# Altium schematic sheet pca10156_sheet2_nRF54L15.SchDoc: =BoardTitle+'- nRF54L15'
size A3; Organization: Nordic Semiconductor; DocumentNumber: 2; SheetNumber: 2; SheetTotal: 7; CompanyName: Nordic Semiconductor; DocumentSize: A4
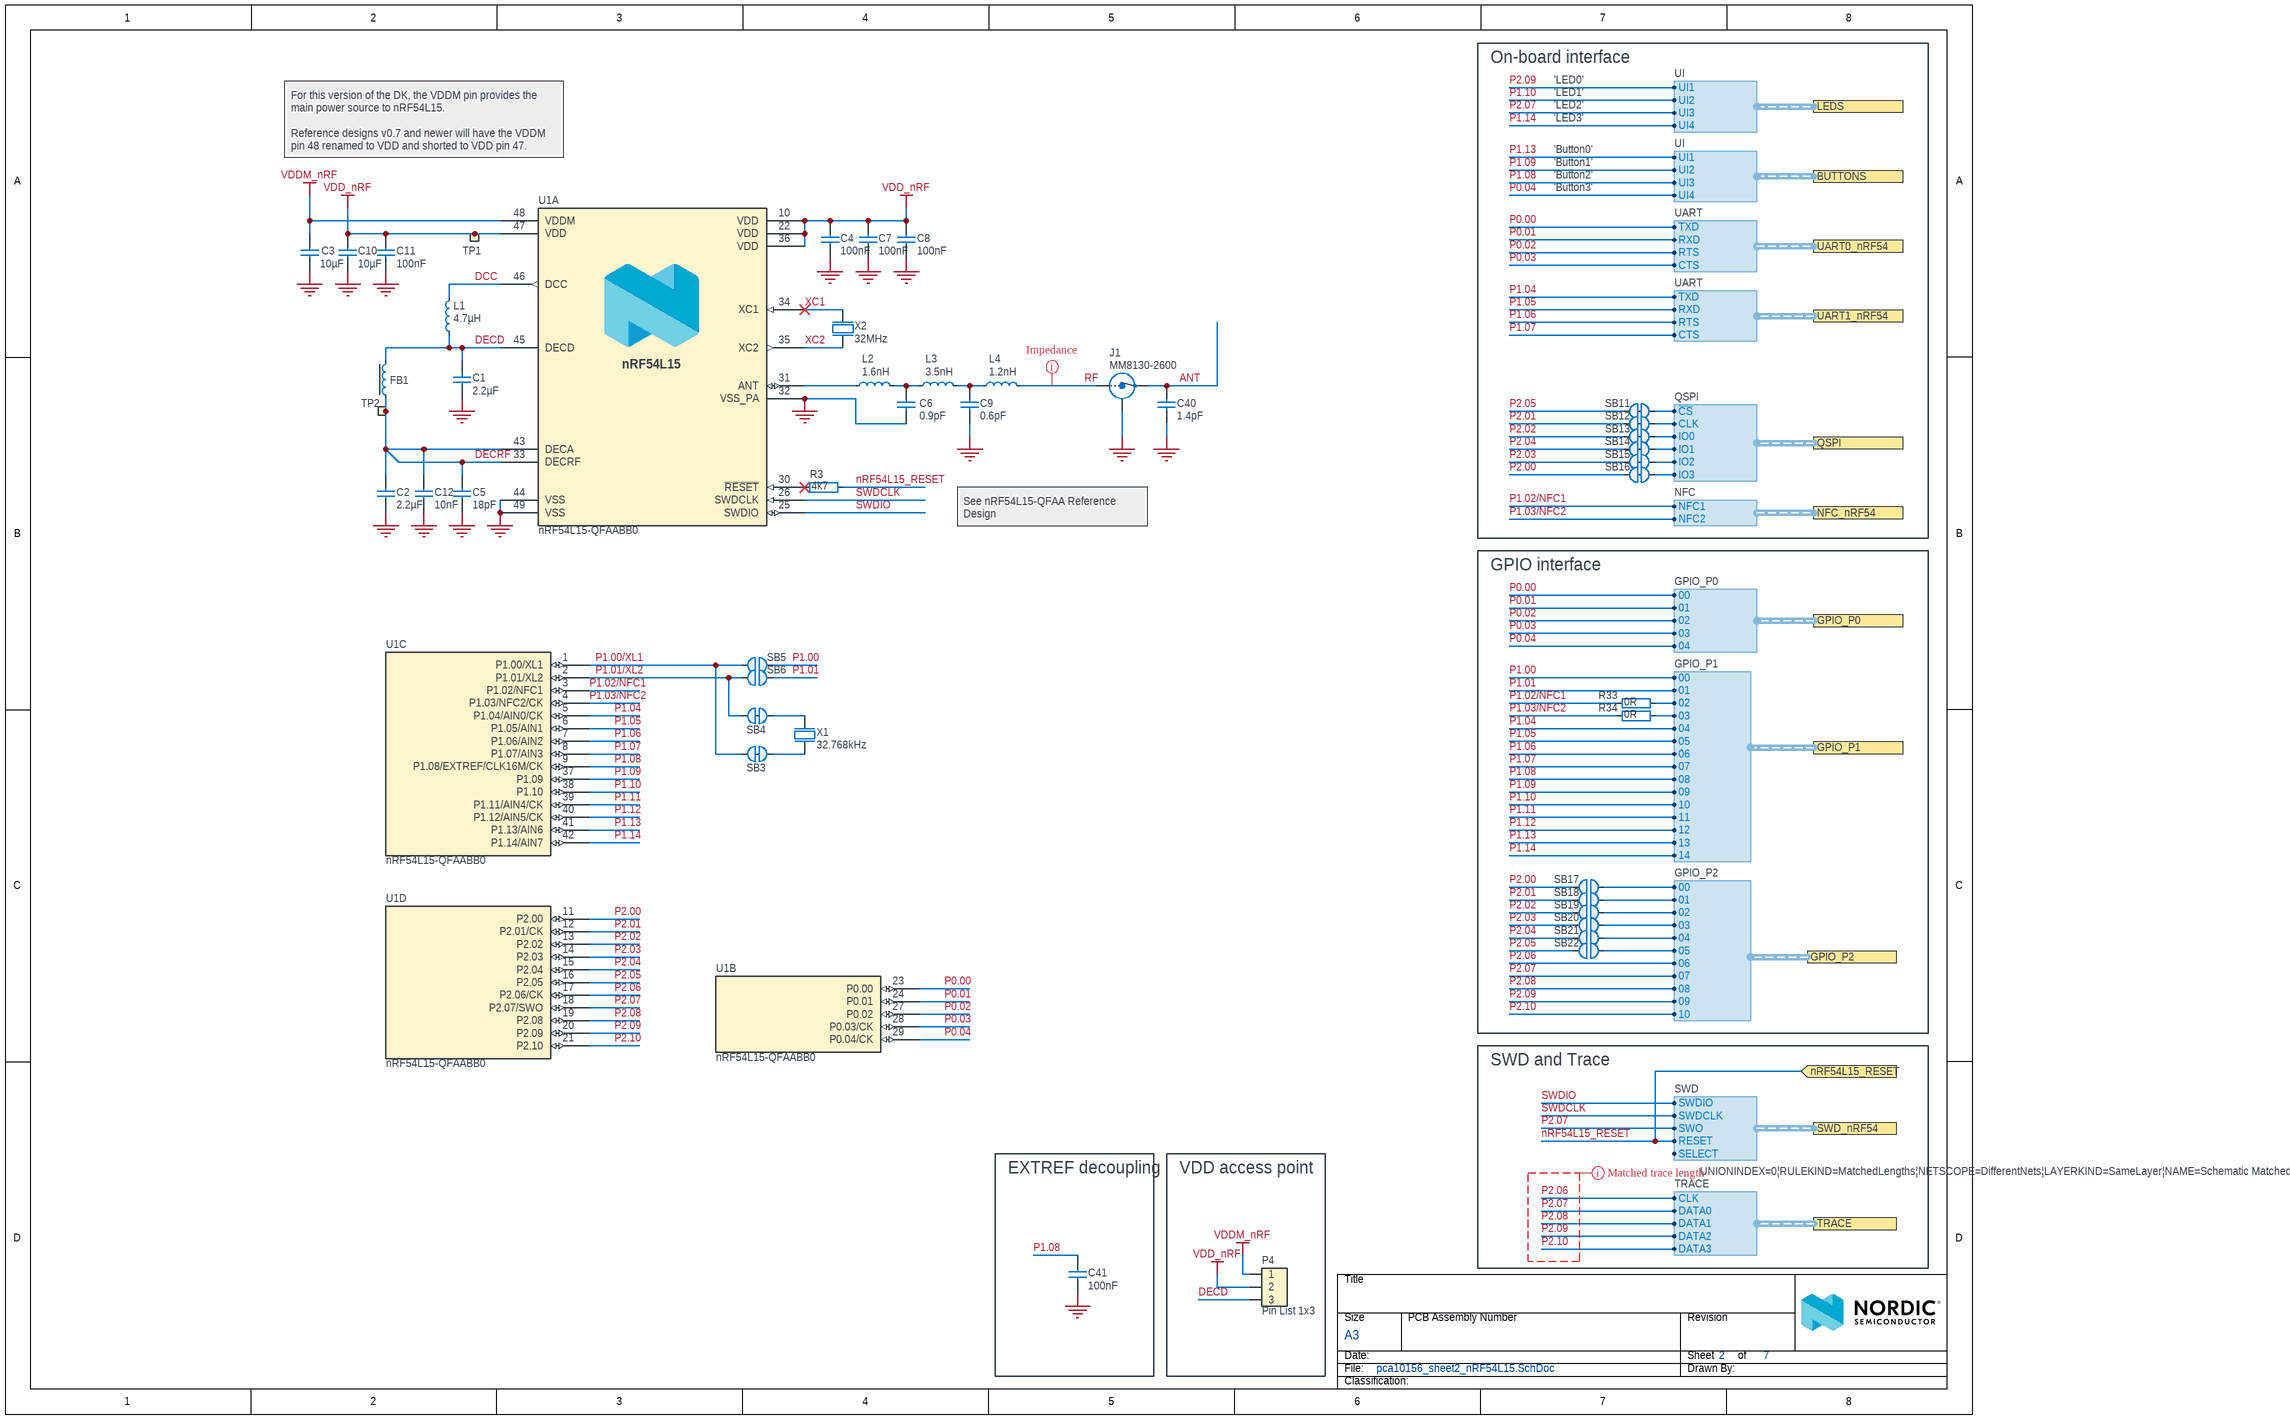
[diagram p0: pca10156_sheet2_nRF54L15.SchDoc]

## Parts
C1  2.2µF  [CAPC0603X03L_C]
C2  2.2µF  [CAPC0603X03L_C]
C3  10µF  [CAPC1005X04L]
C4  100nF  [CAPC0603X03L_C]
C5  18pF  [CAPC0603X03L_C]
C6  0.9pF  [CAPC0603X03L_C]
C7  100nF  [CAPC0603X03L_C]
C8  100nF  [CAPC0603X03L_C]
C9  0.6pF  [CAPC0603X03L_C]
C10  10µF  [CAPC1005X04L]
C11  100nF  [CAPC0603X03L_C]
C12  10nF  [CAPC0603X03L_C]
C40  1.4pF  [CAPC0603X03L_C]
C41  100nF  [CAPC1005X04L]
FB1  120R/0.2A  [INDC0603X03L_C]  (value not drawn)
J1  MM8130-2600  [COAXIAL-SWF]
L1  4.7µH  [INDC1608X06L]
L2  1.6nH  [INDC0603X03L_C]
L3  3.5nH  [INDC0603X03L_C]
L4  1.2nH  [INDC0603X03L_C]
P4  Pin List 1x3  [LIST_1x3]
R3  4k7  [RESC0603X03L_C]
R33  0R  [RESC1005X04L]
R34  0R  [RESC1005X04L]
SB3  Solderbridge  [Solderbridge_SHORTED_0.4]  (value not drawn)  (net tie, no BOM)
SB4  Solderbridge  [Solderbridge_SHORTED_0.4]  (value not drawn)  (net tie, no BOM)
SB5  Solderbridge  [Solderbridge_0.4]  (value not drawn)  (no BOM)
SB6  Solderbridge  [Solderbridge_0.4]  (value not drawn)  (no BOM)
SB11  Solderbridge  [Solderbridge_SHORTED_0.4]  (value not drawn)  (net tie, no BOM)
SB12  Solderbridge  [Solderbridge_SHORTED_0.4]  (value not drawn)  (net tie, no BOM)
SB13  Solderbridge  [Solderbridge_SHORTED_0.4]  (value not drawn)  (net tie, no BOM)
SB14  Solderbridge  [Solderbridge_SHORTED_0.4]  (value not drawn)  (net tie, no BOM)
SB15  Solderbridge  [Solderbridge_SHORTED_0.4]  (value not drawn)  (net tie, no BOM)
SB16  Solderbridge  [Solderbridge_SHORTED_0.4]  (value not drawn)  (net tie, no BOM)
SB17  Solderbridge  [Solderbridge_0.4]  (value not drawn)  (no BOM)
SB18  Solderbridge  [Solderbridge_0.4]  (value not drawn)  (no BOM)
SB19  Solderbridge  [Solderbridge_0.4]  (value not drawn)  (no BOM)
SB20  Solderbridge  [Solderbridge_0.4]  (value not drawn)  (no BOM)
SB21  Solderbridge  [Solderbridge_0.4]  (value not drawn)  (no BOM)
SB22  Solderbridge  [Solderbridge_0.4]  (value not drawn)  (no BOM)
TP1  Ø1.5mm,SMD  [TP_SMD_D1.5mm]  (value not drawn)  (no BOM)
TP2  Ø1.5mm,SMD  [TP_SMD_D1.5mm]  (value not drawn)  (no BOM)
U1  nRF54L15-QFAABB0  [QFN40P600X600X90-48N]  (parts A,B,C,D of 4)
X1  32.768kHz  [XTAL_2012]
X2  32MHz  [BT-XTAL_2016]

## Blocks framed on the sheet
On-board interface: SB11-SB16
GPIO interface: R33 R34 SB17-SB22
EXTREF decoupling: C41
VDD access point: P4

## Ports
BUTTONS (harness UI), GPIO_P0 (harness GPIO_P0), GPIO_P1 (harness GPIO_P1), GPIO_P2 (harness GPIO_P2), LEDS (harness UI), NFC_nRF54 (harness NFC), nRF54L15_RESET (in), QSPI (harness QSPI), SWD_nRF54 (harness SWD), TRACE (harness TRACE), UART0_nRF54 (harness UART), UART1_nRF54 (harness UART)

## Harnesses
SWD: SWDIO, SWDCLK, SWO, RESET, SELECT
NFC: NFC2, NFC1
UART: RTS, CTS, RXD, TXD
GPIO_P1: 00, 01, 02, 03, 04, 05, 06, 07, 08, 09, 10, 11, 12, 13, 14
GPIO_P0: 02, 03, 04, 00, 01
GPIO_P2: 00, 01, 02, 03, 04, 05, 06, 07, 08, 09, 10
QSPI: ~{CS}, IO0, CLK, IO1, IO2, IO3
TRACE: CLK, DATA0, DATA1, DATA3, DATA2
UI: UI2, UI1, UI3, UI4

## Nets
GND: C1.1 C2.1 C3.1 C4.2 C5.1 C6.1 C7.2 C8.2 C9.1 C10.1 C11.2 C12.2 C40.1 C41.1 J1.2(Shield) U1.32(VSS_PA) U1.44(VSS) U1.49(VSS) X2.2(GND) X2.4(GND)
VDD_nRF: C4.1 C7.1 C8.1 C10.2 C11.1 P4.2 TP1.1 U1.10(VDD) U1.22(VDD) U1.36(VDD) U1.47(VDD)
VDDM_nRF: C3.2 P4.1 U1.48(VDDM)
ANT: C40.2 J1.3(OUT)
DCC: L1.2 U1.46(DCC)
DECD: C1.2 FB1.1 L1.1 P4.3 U1.45(DECD)
DECRF: C2.2 C5.2 C12.1 FB1.2 TP2.1 U1.33(DECRF) U1.43(DECA)
nRF54L15_RESET: R3.2 ; port nRF54L15_RESET, port SWD_nRF54.RESET
P0.00: U1.23(P0.00) ; port UART0_nRF54.TXD, port GPIO_P0.00
P0.01: U1.24(P0.01) ; port UART0_nRF54.RXD, port GPIO_P0.01
P0.02: U1.27(P0.02) ; port UART0_nRF54.RTS, port GPIO_P0.02
P0.03: U1.28(P0.03/CK) ; port UART0_nRF54.CTS, port GPIO_P0.03
P0.04: U1.29(P0.04/CK) ; port GPIO_P0.04, port BUTTONS.UI4
P1.00: SB5.2 ; port GPIO_P1.00
P1.00/XL1: SB3.1 SB5.1 U1.1(P1.00/XL1)
P1.01: SB6.2 ; port GPIO_P1.01
P1.01/XL2: SB4.1 SB6.1 U1.2(P1.01/XL2)
P1.02/NFC1: R33.1 U1.3(P1.02/NFC1) ; port NFC_nRF54.NFC1
P1.03/NFC2: R34.1 U1.4(P1.03/NFC2/CK) ; port NFC_nRF54.NFC2
P1.04: U1.5(P1.04/AIN0/CK) ; port GPIO_P1.04, port UART1_nRF54.TXD
P1.05: U1.6(P1.05/AIN1) ; port GPIO_P1.05, port UART1_nRF54.RXD
P1.06: U1.7(P1.06/AIN2) ; port GPIO_P1.06, port UART1_nRF54.RTS
P1.07: U1.8(P1.07/AIN3) ; port GPIO_P1.07, port UART1_nRF54.CTS
P1.08: C41.2 U1.9(P1.08/EXTREF/CLK16M/CK) ; port GPIO_P1.08, port BUTTONS.UI3
P1.09: U1.37(P1.09) ; port GPIO_P1.09, port BUTTONS.UI2
P1.10: U1.38(P1.10) ; port GPIO_P1.10, port LEDS.UI2
P1.11: U1.39(P1.11/AIN4/CK) ; port GPIO_P1.11
P1.12: U1.40(P1.12/AIN5/CK) ; port GPIO_P1.12
P1.13: U1.41(P1.13/AIN6) ; port GPIO_P1.13, port BUTTONS.UI1
P1.14: U1.42(P1.14/AIN7) ; port GPIO_P1.14, port LEDS.UI4
P2.00: SB16.1 SB17.2 U1.11(P2.00)
P2.01: SB12.1 SB18.2 U1.12(P2.01/CK)
P2.02: SB13.1 SB19.2 U1.13(P2.02)
P2.03: SB15.1 SB20.2 U1.14(P2.03)
P2.04: SB14.1 SB21.2 U1.15(P2.04)
P2.05: SB11.1 SB22.2 U1.16(P2.05)
P2.06: U1.17(P2.06/CK) ; port GPIO_P2.06, port TRACE.CLK
P2.07: U1.18(P2.07/SWO) ; port SWD_nRF54.SWO, port GPIO_P2.07, port TRACE.DATA0, port LEDS.UI3
P2.08: U1.19(P2.08) ; port GPIO_P2.08, port TRACE.DATA1
P2.09: U1.20(P2.09) ; port GPIO_P2.09, port TRACE.DATA2, port LEDS.UI1
P2.10: U1.21(P2.10) ; port GPIO_P2.10, port TRACE.DATA3
RF: J1.1(IN) L4.2
SWDCLK: U1.26(SWDCLK) ; port SWD_nRF54.SWDCLK
SWDIO: U1.25(SWDIO) ; port SWD_nRF54.SWDIO
XC1: U1.34(XC1) X2.1(inp)
XC2: U1.35(XC2) X2.3(out)
NetC6_2: C6.2 L2.2 L3.1
NetC9_2: C9.2 L3.2 L4.1
NetL2_1: L2.1 U1.31(ANT)
NetR3_1: R3.1 U1.30(~{RESET})
NetR33_2: R33.2 ; port GPIO_P1.02
NetR34_2: R34.2 ; port GPIO_P1.03
NetSB3_2: SB3.2 X1.2(out)
NetSB4_2: SB4.2 X1.1(inp)
NetSB11_2: SB11.2 ; port QSPI.~{CS}
NetSB12_2: SB12.2 ; port QSPI.CLK
NetSB13_2: SB13.2 ; port QSPI.IO0
NetSB14_2: SB14.2 ; port QSPI.IO1
NetSB15_2: SB15.2 ; port QSPI.IO2
NetSB16_2: SB16.2 ; port QSPI.IO3
NetSB17_1: SB17.1 ; port GPIO_P2.00
NetSB18_1: SB18.1 ; port GPIO_P2.01
NetSB19_1: SB19.1 ; port GPIO_P2.02
NetSB20_1: SB20.1 ; port GPIO_P2.03
NetSB21_1: SB21.1 ; port GPIO_P2.04
NetSB22_1: SB22.1 ; port GPIO_P2.05

## Layout directives
net class TRACE; rule Matched Net Lengths [Delay Tolerance = 500ps]: P2.06, P2.07, P2.08, P2.09, P2.10
net class RF_50ohm: RF

## Notes on the sheet
- 'LED1'
- 'LED0'
- For this version of the DK, the VDDM pin provides the main power source to nRF54L15.
  Reference designs v0.7 and newer will have the VDDM pin 48 renamed to VDD and shorted to VDD pin 47.
- 'LED2'
- 'LED3'
- 'Button1'
- 'Button0'
- 'Button2'
- 'Button3'
- See nRF54L15-QFAA Reference Design
- SWD and Trace
- Title
- Size
- Date:
- File:
- A3
- PCB Assembly Number
- Sheet
- Drawn By:
- Revision
- of
- Classification:
- (in symbol nRF54L15-QFAABB0, part A) nRF54L15

## Library data of the parts
C1 C2 = C0201-2µ2-2.5V-X6T-GRM033D80E225ME47D: Capacitor, Ceramic, 2.2µF 2.5V X6T 0201,±20%; Manufacturer: Murata; Manufacturer Part Number: GRM033R61A225KE47; Part number NEMS: 100200527; Component Status: Active; Pad Count: 2; Note: 2.5V, 20%, X6T; Artikkelnr Noca: N.A.; Part Number: C0201-2µ2-2.5V-X6T-GRM033D80E225ME47D; Component Class: Capacitors; Author: stl1; ComponentLink1URL: https://www.murata.com/products/productdetail?partno=GRM033D80E225ME47%23; ComponentLink1Description: Datasheet; ComponentLink2URL: N.A.; ComponentLink2Description: Supplier link; HelpURL: N.A.; LatestRevisionDate: 2022-02-27; Published: 2022-02-27; Footprint Doc: 0201; Value: 2.2µF; Supplier 1: Mouser; Supplier Part Number 1: 81-GRM033D80E225ME7D; Supplier 2: Digi-Key; Supplier Part Number 2: 490-18653-1-ND; Part number IPS: N.A.; Part number Norautron: N.A.; PartId: 100200527
C3 C10 = C0402-10µF-6.3V-X6S: Capacitor, X6S, ±20%, 6.3V; Manufacturer: N.A.; Part number NEMS: 100200478; Component Status: Active; Pad Count: 2; Part Number: C0402-10µF-6.3V-X6S; PartId: 100200478; Component Class: Capacitors; Author: getr; Manufacturer Part Number: N.A.; ComponentLink1URL: N.A.; ComponentLink1Description: Datasheet; ComponentLink2URL: N.A.; ComponentLink2Description: Supplier link; HelpURL: N.A.; LatestRevisionDate: 2021-06-25; Published: 2021-06-25; Footprint Doc: 0402; Value: 10µF; Note: 6.3V; Supplier 1: N.A.; Supplier Part Number 1: N.A.; Supplier 2: N.A.; Supplier Part Number 2: N.A.; Artikkelnr Noca: N.A.; Part number IPS: N.A.; Part number Norautron: N.A.
C4 C7 C8 C11 = C0201-100n: Capacitor, X5R, ±10%; Manufacturer: N.A.; Part number IPS: 00000001248, 00000002505; Part number Norautron: 262071862; Part number NEMS: 100200078; Pad Count: 2; Note: 16V; Component Status: Active; Part Number: C0201-100n; LatestRevisionDate: 2017-11-09; Published: 2014-11-13; Value: 100nF; Footprint Doc: 0201; Component Class: Capacitors; PartId: 100200078; Author: rsk; Manufacturer Part Number: N.A.; ComponentLink1URL: N.A.; ComponentLink1Description: Datasheet; ComponentLink2URL: N.A.; ComponentLink2Description: Supplier link; HelpURL: N.A.; Supplier 1: N.A.; Supplier Part Number 1: N.A.; Supplier 2: N.A.; Supplier Part Number 2: N.A.; Artikkelnr Noca: N.A.
C5 = C0201-18p: Capacitor, C0G, ±5%, 25V; Manufacturer: Walsin Technology Corporation; Manufacturer Part Number: 0201N180J250CT; Part number IPS: 00000000862; Part number Norautron: 26207023; Part number NEMS: 100200035; Component Status: Active; Pad Count: 2; Note: Chip Cap 5%; Artikkelnr Noca: N.A.; Part Number: C0201-18p; PartId: 100200035; Component Class: Capacitors; Author: rsk; ComponentLink1URL: N.A.; ComponentLink1Description: Datasheet; ComponentLink2URL: N.A.; ComponentLink2Description: Supplier link; HelpURL: N.A.; LatestRevisionDate: 2020-10-13; Published: 2014-11-13; Footprint Doc: 0201; Value: 18pF; Supplier 1: N.A.; Supplier Part Number 1: N.A.; Supplier 2: N.A.; Supplier Part Number 2: N.A.
C6 = C0201-0p9-GJM0335C1ER90BB01: Capacitor, C0G, ±0.1pF, 25V; Manufacturer: Murata; Manufacturer Part Number: GJM0335C1ER90BB01D; Component Status: Active; Pad Count: 2; Note: ±0.1pF, -55°C ~ 125°C; Artikkelnr Noca: N.A.; Part Number: C0201-0p9-GJM0335C1ER90BB01; Component Class: Capacitors; Author: stl1; ComponentLink1URL: N.A.; ComponentLink1Description: Datasheet; ComponentLink2URL: N.A.; ComponentLink2Description: Supplier link; HelpURL: https://www.murata.com/products/productdetail?partno=GJM0335C1ER90BB01%23; LatestRevisionDate: 2024-06-19; Published: 2024-06-19; Footprint Doc: 0201; Value: 0.9pF; Supplier 1: Digi-Key; Supplier Part Number 1: 490-11185-2-ND; Supplier 2: Mouser; Supplier Part Number 2: 81-GJM0335C1ER90BB1D; Part number IPS: N.A.; Part number Norautron: N.A.; PartId: 100200663
C9 = C0201-0.6p-25V-GJM0335C1ER60BB01: Capacitor, C0G, ±0.1pF, 25V; Manufacturer: Murata; Part number NEMS: 100200648; Component Status: Active; Pad Count: 2; Artikkelnr Noca: N.A.; Part Number: C0201-0.6p-25V-GJM0335C1ER60BB01; PartId: 100200648; Component Class: Capacitors; Author: masi; Manufacturer Part Number: GJM0335C1ER60BB01; ComponentLink1URL: https://www.murata.com/en-eu/products/productdetail?partno=GJM0335C1ER60BB01%23; ComponentLink1Description: Datasheet; ComponentLink2URL: N.A.; ComponentLink2Description: Supplier link; HelpURL: N.A.; LatestRevisionDate: 2024-01-10; Published: 2024-01-10; Footprint Doc: 0201; Value: 0.6pF; Note: 25V; Supplier 1: Digi-Key; Supplier Part Number 1: 490-6070-2-ND; Supplier 2: Mouser; Supplier Part Number 2: 81-GJM0335C1ER60BB1D; Part number IPS: N.A.; Part number Norautron: N.A.
C12 = C0201-10n: Capacitor, X7R, ±10%; Manufacturer: N.A.; Part number IPS: 00000003480; Part number Norautron: 26621779; Part number NEMS: 100200067; Note: 10V; Pad Count: 2; Component Status: Active; Part Number: C0201-10n; Manufacturer Part Number: N.A.; LatestRevisionDate: 2017-11-09; Published: 2014-11-13; Value: 10nF; Artikkelnr Noca: N.A.; Footprint Doc: 0201; ComponentLink1URL: N.A.; ComponentLink1Description: Datasheet; ComponentLink2URL: N.A.; ComponentLink2Description: Supplier link; HelpURL: N.A.; Supplier 1: N.A.; Supplier Part Number 1: N.A.; Supplier 2: N.A.; Supplier Part Number 2: N.A.; Component Class: Capacitors; PartId: 100200067; Author: rsk
C40 = C0201-1.4p-25V-GJM0335C1E1R4WB01D: Capacitor, C0G, ±0.05pF, 25V; Manufacturer: Murata; Part number NEMS: 100200553; Pad Count: 2; Artikkelnr Noca: N.A.; Component Status: Active; Part Number: C0201-1.4p-25V-GJM0335C1E1R4WB01D; PartId: 100200553; Component Class: Capacitors; Author: stl1; Manufacturer Part Number: GJM0335C1E1R4WB01D; ComponentLink1URL: https://www.murata.com/products/productdetail?partno=GJM0335C1E1R4WB01%23; ComponentLink1Description: Datasheet; ComponentLink2URL: N.A.; ComponentLink2Description: Supplier link; HelpURL: N.A.; Footprint Doc: 0201; LatestRevisionDate: 2023-05-30; Published: 2023-05-30; Value: 1.4pF; Note: 25V; Supplier 1: Digi-Key; Supplier Part Number 1: 490-GJM0335C1E1R4WB01DTR-ND; Supplier 2: Mouser; Supplier Part Number 2: 81-GJM0335C1E1R4WB1D; Part number IPS: N.A.; Part number Norautron: N.A.
C41 = C0402-100n: Capacitor, X7R, ±10%; Manufacturer: N.A.; Part number IPS: 00000005296; Part number NEMS: 100200184; Component Status: Active; Pad Count: 2; Note: 16V; Artikkelnr Noca: 20039200; Assembly: Not Mounted; Part Number: C0402-100n; PartId: 100200184; Component Class: Capacitors; Author: rsk; Manufacturer Part Number: N.A.; ComponentLink1URL: N.A.; ComponentLink1Description: Datasheet; ComponentLink2URL: N.A.; ComponentLink2Description: Supplier link; HelpURL: N.A.; LatestRevisionDate: 2009-11-23; Published: 2009-05-08; Footprint Doc: 0402; Value: 100nF; Supplier 1: N.A.; Supplier Part Number 1: N.A.; Supplier 2: N.A.; Supplier Part Number 2: N.A.; Part number Norautron: N.A.
FB1 = FB0201-120R@100M-200mA-BLM03AG121SN1D: Ferrite Bead, 120 Ohm @ 100MHz, 200mA, 500 mOhm Max; Manufacturer: Murata; Part number NEMS: 100300419; Component Status: Active; Pad Count: 2; Artikkelnr Noca: N.A.; Part Number: FB0201-120R@100M-200mA-BLM03AG121SN1D; Component Class: Inductors; Author: stl1; Manufacturer Part Number: BLM03AG121SN1D; ComponentLink1URL: https://www.murata.com/en-eu/products/productdetail?partno=BLM03AG121SN1%23; ComponentLink1Description: Datasheet; ComponentLink2URL: N.A.; ComponentLink2Description: Supplier link; HelpURL: N.A.; LatestRevisionDate: 2022-02-27; Published: 2022-02-27; Footprint Doc: 0201; Value: 120R/0.2A; Note: Ferrite Bead; Supplier 1: Digi-Key; Supplier Part Number 1: 490-5622-1-ND; Supplier 2: Mouser; Supplier Part Number 2: 81-BLM03AX121SN1D; Part number IPS: N.A.; Part number Norautron: N.A.; PartId: 100300419
J1 = MM8130-2600: Coaxial Connector with Switch; Manufacturer: Murata; Part number IPS: 00000009955; Part number Norautron: 26030338; Part number NEMS: 100500400; Component Status: Active; Pad Count: 3; Note: N.A.; Artikkelnr Noca: 55029011; Part Number: MM8130-2600; PartId: 100500400; Component Class: Connectors; Author: rsk; Manufacturer Part Number: MM8130-2600; ComponentLink1URL: N.A.; ComponentLink1Description: Datasheet; ComponentLink2URL: N.A.; ComponentLink2Description: Supplier link; HelpURL: http://www.murata.com/products/catalog/pdf/o33e.pdf; LatestRevisionDate: 2014-04-24; Published: 2014-04-24; Footprint Doc: COAXIAL-SWF; Value: MM8130-2600; Supplier 1: Digi-Key; Supplier Part Number 1: 490-4981-1-ND; Supplier 2: Mouser; Supplier Part Number 2: 81-MM8130-2600RA2; System: Connector
L1 = L0603-4µ7-MLZ1608M4R7WT000: Inductor, 120mA, ±20%, 0.65R; Manufacturer: TDK Corporation; Part number NEMS: 100300440; Component Status: Active; Pad Count: 2; Note: Power Inductor ±20%; Artikkelnr Noca: N.A.; Part Number: L0603-4µ7-MLZ1608M4R7WT000; PartId: 100300440; Component Class: Inductors; Author: stl1; Manufacturer Part Number: MLZ1608M4R7WT000; ComponentLink1URL: https://product.tdk.com/en/search/inductor/inductor/smd/info?part_no=MLZ1608M4R7WT000; ComponentLink1Description: Datasheet; ComponentLink2URL: N.A.; ComponentLink2Description: Supplier link; HelpURL: N.A.; LatestRevisionDate: 2023-05-10; Published: 2023-05-10; Footprint Doc: 0603; Value: 4.7µH; Supplier 1: Digi-Key; Supplier Part Number 1: 445-6390-2-ND; Supplier 2: Mouser; Supplier Part Number 2: 810-MLZ1608M4R7WT000; Part number IPS: N.A.; Part number Norautron: N.A.
L2 = L0201-1n6-LQP03HQ1N6W02: Inductor, 1000mA, ±0.05ｎH, 50mOhm; Manufacturer: Murata; Component Status: Active; Pad Count: 2; Note: ±0.05nH, -55°C ~ 125°C; Artikkelnr Noca: N.A.; Part Number: L0201-1n6-LQP03HQ1N6W02; Component Class: Inductors; Author: stl1; Manufacturer Part Number: LQP03HQ1N6W02; ComponentLink1URL: https://search.murata.co.jp/Ceramy/image/img/P02/JELF243C-0021.pdf; ComponentLink1Description: Datasheet; ComponentLink2URL: N.A.; ComponentLink2Description: Supplier link; HelpURL: https://psearch.en.murata.com/inductor/product/LQP03HQ1N6B02%23.html; LatestRevisionDate: 2024-06-19; Published: 2024-06-19; Footprint Doc: 0201; Value: 1.6nH; Supplier 1: Digi-Key; Supplier Part Number 1: 490-LQP03HQ1N6W02DTR-ND; Supplier 2: Mouser; Supplier Part Number 2: 81-LQP03HQ1N6W02D; Part number IPS: N.A.; Part number Norautron: N.A.; PartId: 100300497
L3 = L0201-3n5-HQ-Murata: Inductor, 500mA, ±0.1ｎH, 170mOhm; Manufacturer: Murata; Manufacturer Part Number: LQP03HQ3N5B02; Part number NEMS: 100300222; Component Status: Active; Pad Count: 2; Note: -55°C ~ 125°C; Artikkelnr Noca: N.A.; Part Number: L0201-3n5-HQ-Murata; PartId: 100300222; Component Class: Inductors; Author: rsk; ComponentLink1URL: https://search.murata.co.jp/Ceramy/image/img/P02/JELF243C-0021.pdf; ComponentLink1Description: Datasheet; ComponentLink2URL: N.A.; ComponentLink2Description: Supplier link; HelpURL: https://psearch.en.murata.com/inductor/product/LQP03HQ3N5B02%23.html; LatestRevisionDate: 2018-10-23; Published: 2018-10-23; Footprint Doc: 0201; Value: 3.5nH; Supplier 1: Digi-Key; Supplier Part Number 1: 490-13925-1-ND; Supplier 2: N.A.; Supplier Part Number 2: N.A.; Part number IPS: N.A.; Part number Norautron: N.A.
L4 = L0201-1n2-HQ-Murata: Inductor, 1100mA, ±0.05ｎH, 40mOhm; Manufacturer: Murata; Manufacturer Part Number: LQP03HQ1N2W02; Part number NEMS: 100300199; Component Status: Active; Pad Count: 2; Note: -55°C ~ 125°C; Artikkelnr Noca: N.A.; Part Number: L0201-1n2-HQ-Murata; PartId: 100300199; Component Class: Inductors; Author: rsk; ComponentLink1URL: https://search.murata.co.jp/Ceramy/image/img/P02/JELF243C-0021.pdf; ComponentLink1Description: Datasheet; ComponentLink2URL: N.A.; ComponentLink2Description: Supplier link; HelpURL: https://psearch.en.murata.com/inductor/product/LQP03HQ1N2W02%23.html; LatestRevisionDate: 2018-10-23; Published: 2018-10-23; Footprint Doc: 0201; Value: 1.2nH; Supplier 1: Digi-Key; Supplier Part Number 1: 490-13876-1-ND; Supplier 2: N.A.; Supplier Part Number 2: N.A.; Part number IPS: N.A.; Part number Norautron: N.A.
P4 = Pin List 1x3: Pin List 1x3, 2.54mm (100mil); Manufacturer: N.A.; Part number NEMS: 100500304; Component Status: Active; Pad Count: 3; Artikkelnr Noca: 56019041; Assembly: Not Mounted; System: Connector; Part Number: Pin List 1x3; PartId: 100500304; Component Class: Connectors; Author: rsk; Manufacturer Part Number: N.A.; ComponentLink1URL: N.A.; ComponentLink1Description: Datasheet; ComponentLink2URL: N.A.; ComponentLink2Description: Supplier link; HelpURL: N.A.; LatestRevisionDate: 2009-12-12; Published: 2009-12-12; Footprint Doc: LIST_1x3; Value: Pin List 1x3; Note: N.A.; Supplier 1: N.A.; Supplier Part Number 1: N.A.; Supplier 2: N.A.; Supplier Part Number 2: N.A.; Part number IPS: N.A.; Part number Norautron: N.A.
R3 = R0201-4k7: Resistor, ±1%, 0.05W; Manufacturer: N.A.; Part number IPS: 00000001706; Part number NEMS: 100100061; Component Status: Active; Pad Count: 2; Note: Chip Res 1%; Part Number: R0201-4k7; PartId: 100100061; Component Class: Resistors; Author: rsk; Manufacturer Part Number: N.A.; ComponentLink1URL: N.A.; ComponentLink1Description: Datasheet; ComponentLink2URL: N.A.; ComponentLink2Description: Supplier link; HelpURL: N.A.; LatestRevisionDate: 2014-11-13; Published: 2014-11-13; Footprint Doc: 0201; Value: 4k7; Supplier 1: N.A.; Supplier Part Number 1: N.A.; Supplier 2: N.A.; Supplier Part Number 2: N.A.; Artikkelnr Noca: N.A.; Part number Norautron: N.A.
R33 R34 = R0402-0R: Resistor, ±5%, 0.063W; Manufacturer: N.A.; Part number IPS: 00000007128; Part number NEMS: 100100109; Component Status: Active; Pad Count: 2; Note: Chip Res 5%; Artikkelnr Noca: 27049000; Assembly: Not Mounted; Part Number: R0402-0R; PartId: 100100109; Component Class: Resistors; Author: rsk; Manufacturer Part Number: N.A.; ComponentLink1URL: N.A.; ComponentLink1Description: Datasheet; ComponentLink2URL: N.A.; ComponentLink2Description: Supplier link; HelpURL: N.A.; LatestRevisionDate: 2009-11-23; Published: 2009-05-08; Footprint Doc: 0402; Value: 0R; Supplier 1: Farnell; Supplier Part Number 1: 146-9661; Supplier 2: N.A.; Supplier Part Number 2: N.A.; Part number Norautron: N.A.
SB3 SB4 SB11-SB16 = Solderbridge Shorted 0.4mm: Shorted Solderbridge; Manufacturer: N.A.; Part number NEMS: 100500561; Component Status: Active; Pad Count: 2; System: Connector; Part Number: Solderbridge Shorted 0.4mm; PartId: 100500561; Component Class: Connectors; Author: rsk; Manufacturer Part Number: N.A.; ComponentLink1URL: N.A.; ComponentLink1Description: Datasheet; ComponentLink2URL: N.A.; ComponentLink2Description: Supplier link; HelpURL: N.A.; LatestRevisionDate: 2012-08-07; Published: 2012-08-07; Footprint Doc: Solderbridge_Shorted; Value: Solderbridge; Note: N.A.; Supplier 1: N.A.; Supplier Part Number 1: N.A.; Supplier 2: N.A.; Supplier Part Number 2: N.A.; Artikkelnr Noca: N.A.; Part number IPS: N.A.; Part number Norautron: N.A.
SB5 SB6 SB17-SB22 = Solderbridge 0.4mm: Manufacturer: N.A.; Part number NEMS: 100500560; Component Status: Active; Pad Count: 2; System: Connector; Part Number: Solderbridge 0.4mm; PartId: 100500560; Component Class: Connectors; Author: rsk; Manufacturer Part Number: N.A.; ComponentLink1URL: N.A.; ComponentLink1Description: Datasheet; ComponentLink2URL: N.A.; ComponentLink2Description: Supplier link; HelpURL: N.A.; LatestRevisionDate: 2009-12-14; Published: 2009-12-14; Footprint Doc: Solderbridge; Value: Solderbridge; Note: N.A.; Supplier 1: N.A.; Supplier Part Number 1: N.A.; Supplier 2: N.A.; Supplier Part Number 2: N.A.; Artikkelnr Noca: N.A.; Part number IPS: N.A.; Part number Norautron: N.A.
TP1 TP2 = TP_SMD_Ø1.5MM: 1.5mm circular SMD testpad; Manufacturer: Nordic Semiconductor; Manufacturer Part Number: N.A.; Part number NEMS: 100500477; Pad Count: 1; Component Status: Active; Part Number: TP_SMD_Ø1.5MM; ComponentLink1URL: N.A.; ComponentLink1Description: Datasheet; ComponentLink2URL: N.A.; ComponentLink2Description: Supplier link; HelpURL: N.A.; Footprint Doc: TP_SMD_Ø1.5mm; LatestRevisionDate: 2021-03-05; Published: 2016-06-02; Value: Ø1.5mm,SMD; Note: N.A.; Supplier 1: N.A.; Supplier Part Number 1: N.A.; Supplier 2: N.A.; Supplier Part Number 2: N.A.; Artikkelnr Noca: N.A.; Part number IPS: N.A.; Component Class: Connectors; PartId: 100500477; Author: rsk; Part number Norautron: N.A.
U1 = nRF54L15-QFAABB0: Multi-protocol Bluetooth Low Energy, IEEE 802.15.4, ANT and 2.4GHz proprietary system-on-chip; Manufacturer: Nordic Semiconductor; Component Status: Active; Pad Count: 49; Note: N.A.; Part Number: nRF54L15-QFAABB0; Component Class: Nordic_Devices; Author: stl1; Manufacturer Part Number: nRF54L15-QFAABB0; ComponentLink1URL: N.A.; ComponentLink1Description: Datasheet; ComponentLink2URL: N.A.; ComponentLink2Description: Supplier link; HelpURL: N.A.; LatestRevisionDate: 2024-06-19; Published: 2024-06-19; Footprint Doc: QFN-48; Value: nRF54L15-QFAABB0; Supplier 1: Nordic Semiconductor; Supplier Part Number 1: nRF54L15-QFAABB0; Supplier 2: N.A.; Supplier Part Number 2: N.A.; Artikkelnr Noca: N.A.; Part number IPS: N.A.; Part number Norautron: N.A.; PartId: 102000348
X1 = XTAL_SMD2012_32.768kHz_9pF_TXC: XTAL SMD 2012, 32.768kHz, 9pF, ±20ppm; Manufacturer: TXC Corporation; Manufacturer Part Number: 9HT11-32.768KDZC-T; Part number NEMS: 101600107; Component Status: Active; Pad Count: 2; Note: XTAL SMD 32.768kHz; Artikkelnr Noca: N.A.; Part Number: XTAL_SMD2012_32.768kHz_9pF_TXC; PartId: 101600107; Component Class: Oscillators; Author: eisk; ComponentLink1URL: http://www.txccrystal.com/images/pdf/9ht11.pdf; ComponentLink1Description: Datasheet; ComponentLink2URL: https://www.digikey.com/en/products/detail/9HT11-32.768KDZC-T/887-1426-1-ND/2403277; ComponentLink2Description: Supplier link; HelpURL: http://www.txccrystal.com/images/pdf/9ht11.pdf; LatestRevisionDate: 2023-03-14; Published: 2014-03-28; Footprint Doc: XTAL_2012; Value: 32.768kHz; Supplier 1: Digi-Key; Supplier Part Number 1: 887-1426-2-ND; Supplier 2: Mouser; Supplier Part Number 2: 717-9HT11-32.7KDZC-T; Part number IPS: N.A.; Part number Norautron: N.A.
X2 = XTAL_SMD2016_32MHz_8pF_Golledge: XTAL SMD 2016, 32MHz, Cl=8pF, Tol: ±10ppm, Stab: ±15ppm; Manufacturer Part Number: MP06003; Part number IPS: 00000001431; Part number Norautron: N.A.; Part number NEMS: 101600041; Component Status: Active; Pad Count: 4; Note: XTAL SMD 32.000MHz; Artikkelnr Noca: 22010050; Part Number: XTAL_SMD2016_32MHz_8pF_Golledge; PartId: 101600041; Component Class: Oscillators; Author: rsk; Manufacturer: Golledge; ComponentLink1URL: N.A.; ComponentLink1Description: Datasheet; ComponentLink2URL: N.A.; ComponentLink2Description: Supplier link; HelpURL: \\hizz\pro\app9717\Datasheet\crystals\Golledge\mp06003.pdf; LatestRevisionDate: 2016-11-02; Published: 2016-11-02; Footprint Doc: XTAL_2016; Value: 32MHz; Supplier 1: Link Nordic; Supplier Part Number 1: N.A.; Supplier 2: N.A.; Supplier Part Number 2: N.A.